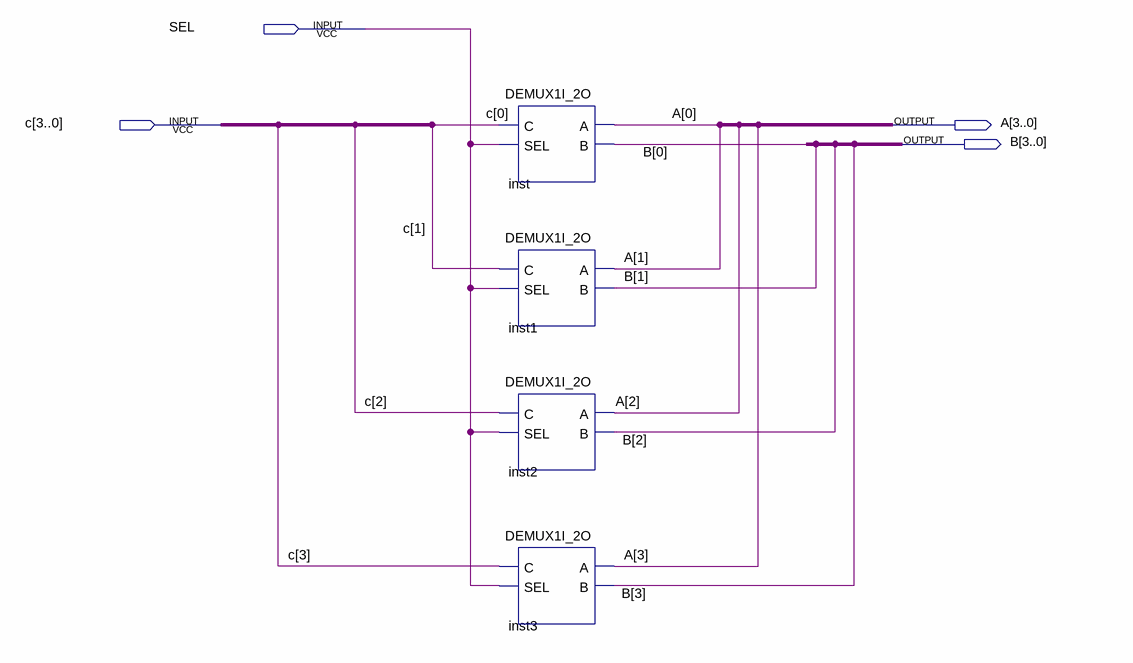
[diagram p0: schematic sheet]
// Quartus schematic DEMUX4BIT2WAY.bdf as structural Verilog: 4 symbols, 4 pins
module DEMUX4BIT2WAY (
  input  SEL,
  input  [3:0] c,
  output [3:0] A,
  output [3:0] B
);

  DEMUX1I_2O inst (.C(c[0]), .SEL(SEL), .A(A[0]), .B(B[0]));
  DEMUX1I_2O inst1 (.C(c[1]), .SEL(SEL), .A(A[1]), .B(B[1]));
  DEMUX1I_2O inst2 (.C(c[2]), .SEL(SEL), .A(A[2]), .B(B[2]));
  DEMUX1I_2O inst3 (.C(c[3]), .SEL(SEL), .A(A[3]), .B(B[3]));
endmodule
